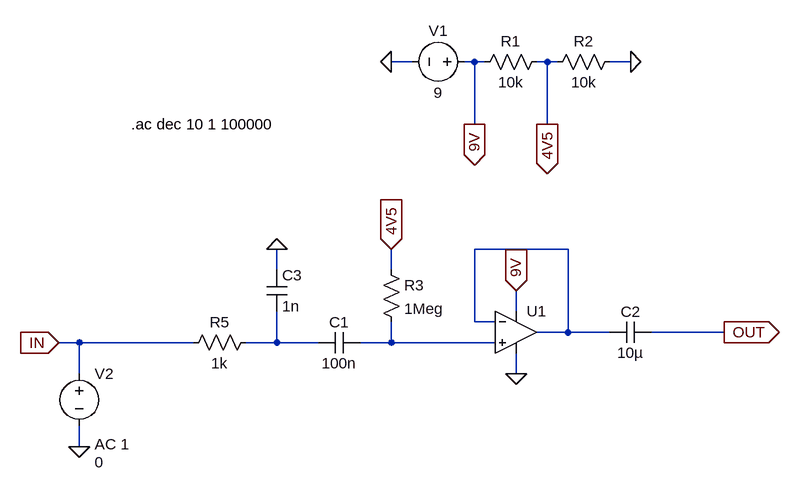
[diagram p0: schematic InputBuffer.asc]
InputBuffer.asc, the LTspice schematic file:
Version 4
SHEET 1 880 800
WIRE 224 96 192 96
WIRE 320 96 304 96
WIRE 336 96 320 96
WIRE 432 96 416 96
WIRE 448 96 432 96
WIRE 560 96 528 96
WIRE 320 192 320 96
WIRE 432 192 432 96
WIRE 464 384 320 384
WIRE 16 416 16 384
WIRE 192 416 192 384
WIRE 384 480 384 448
WIRE 320 496 320 384
WIRE 352 496 320 496
WIRE 464 512 464 384
WIRE 464 512 416 512
WIRE 528 512 464 512
WIRE 704 512 592 512
WIRE -288 528 -320 528
WIRE -112 528 -288 528
WIRE 16 528 16 480
WIRE 16 528 -32 528
WIRE 80 528 16 528
WIRE 192 528 192 496
WIRE 192 528 144 528
WIRE 352 528 192 528
WIRE -288 576 -288 528
WIRE 384 576 384 544
WIRE -288 688 -288 656
FLAG 384 576 0
FLAG 192 96 0
FLAG 560 96 0
FLAG 320 192 9V
IOPIN 320 192 Out
FLAG 432 192 4V5
IOPIN 432 192 Out
FLAG 384 448 9V
IOPIN 384 448 In
FLAG 192 384 4V5
IOPIN 192 384 In
FLAG 704 512 OUT
IOPIN 704 512 Out
FLAG -320 528 IN
IOPIN -320 528 In
FLAG -288 688 0
FLAG 16 384 0
DATAFLAG -240 528 ""
SYMBOL OpAmps\\UniversalOpAmp 384 512 R0
SYMATTR InstName U1
SYMBOL voltage 320 96 R90
WINDOW 0 -32 56 VBottom 2
WINDOW 3 32 56 VTop 2
WINDOW 123 0 0 Left 0
WINDOW 39 0 0 Left 0
SYMATTR InstName V1
SYMATTR Value 9
SYMBOL res 432 80 R90
WINDOW 0 0 56 VBottom 2
WINDOW 3 32 56 VTop 2
SYMATTR InstName R1
SYMATTR Value 10k
SYMBOL res 544 80 R90
WINDOW 0 0 56 VBottom 2
WINDOW 3 32 56 VTop 2
SYMATTR InstName R2
SYMATTR Value 10k
SYMBOL res 176 400 R0
SYMATTR InstName R3
SYMATTR Value 1Meg
SYMBOL cap 144 512 R90
WINDOW 0 0 32 VBottom 2
WINDOW 3 32 32 VTop 2
SYMATTR InstName C1
SYMATTR Value 100n
SYMBOL cap 592 496 R90
WINDOW 0 0 32 VBottom 2
WINDOW 3 32 32 VTop 2
SYMATTR InstName C2
SYMATTR Value 10µ
SYMBOL voltage -288 560 R0
WINDOW 3 24 152 Left 2
WINDOW 123 24 124 Left 2
WINDOW 39 0 0 Left 0
SYMATTR InstName V2
SYMATTR Value 0
SYMATTR Value2 AC 1
SYMBOL res -16 512 R90
WINDOW 0 0 56 VBottom 2
WINDOW 3 32 56 VTop 2
SYMATTR InstName R5
SYMATTR Value 1k
SYMBOL cap 0 416 R0
SYMATTR InstName C3
SYMATTR Value 1n
TEXT -208 192 Left 2 !.ac dec 10 1 100000

The netlist it stands for:
* InputBuffer.asc
XU1 N003 N001 9V 0 N001 level1 Avol=1Meg GBW=10Meg Vos=0 En=0 Enk=0 In=0 Ink=0 Rin=500Meg  ; pins In+ In- V+ V- OUT
V1 9V 0 9
R1 4V5 9V 10k
R2 0 4V5 10k
R3 4V5 N003 1Meg
C1 N003 N002 100n
C2 OUT N001 10µ
V2 IN 0 0 AC 1
R5 N002 IN 1k
C3 0 N002 1n
.ac dec 10 1 100000
.lib UniversalOpAmp1.lib
.backanno
.end